# Altium schematic sheet sensor.SchDoc
size A4; SheetNumber: 1; SheetTotal: 1
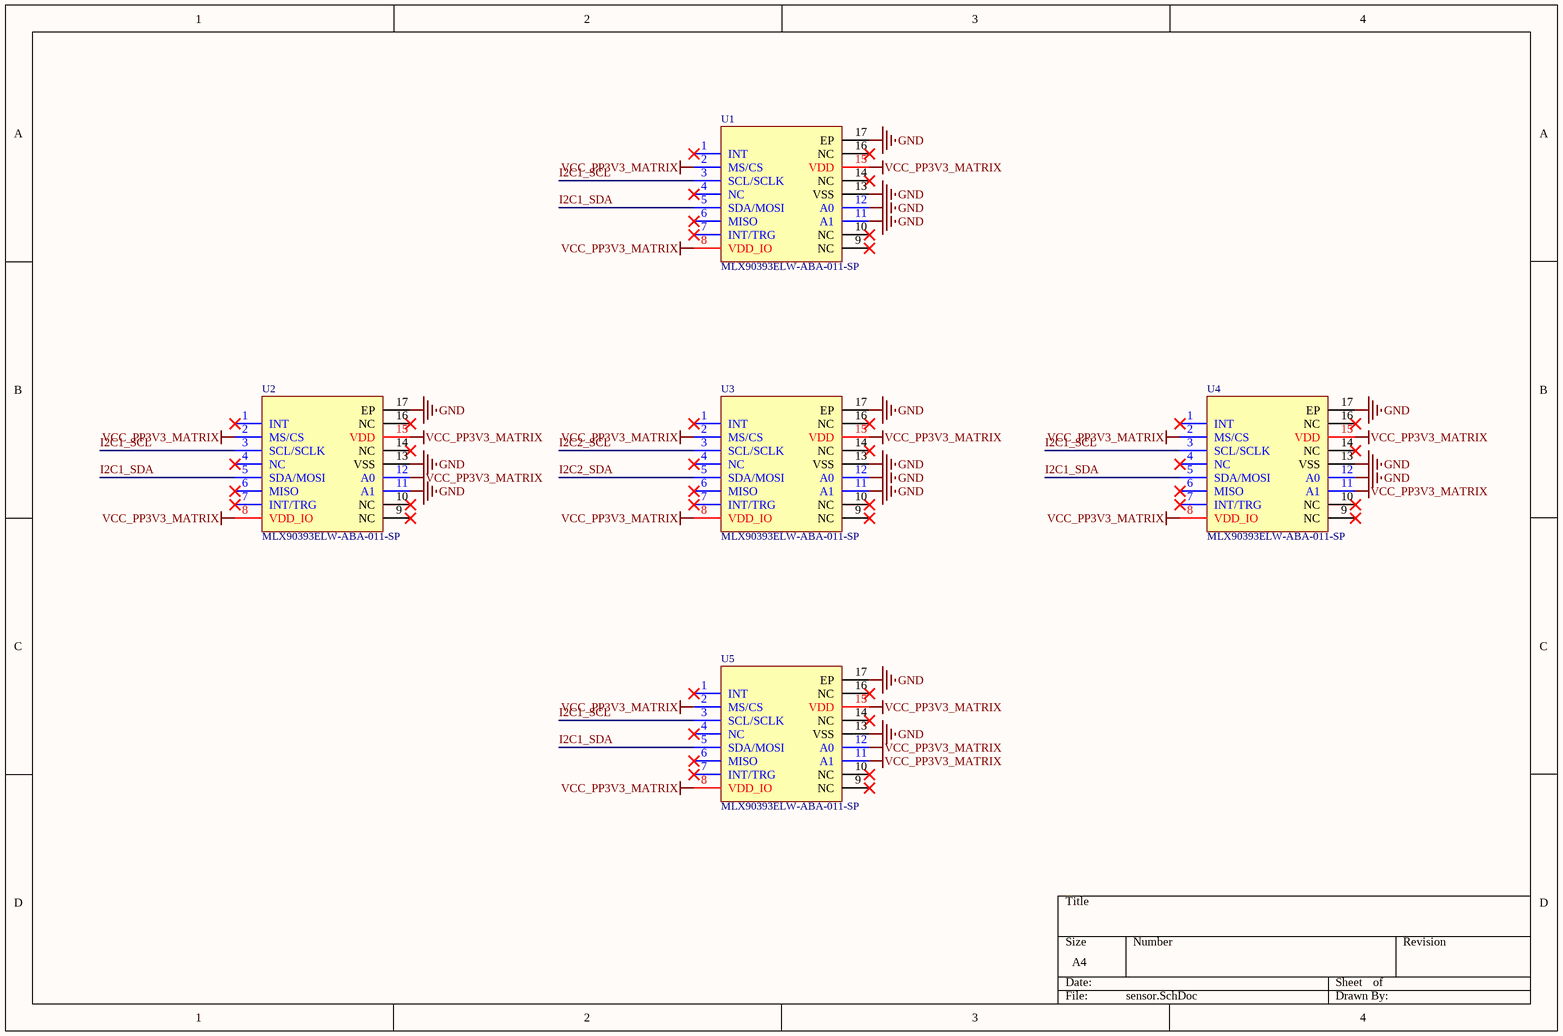
[diagram p0: sensor.SchDoc]

## Parts
U1  MLX90393ELW-ABA-011-SP  [QFN-16_L3.0-W3.0-P0.50-TR-EP1.7]
U2  MLX90393ELW-ABA-011-SP  [QFN-16_L3.0-W3.0-P0.50-TR-EP1.7]
U3  MLX90393ELW-ABA-011-SP  [QFN-16_L3.0-W3.0-P0.50-TR-EP1.7]
U4  MLX90393ELW-ABA-011-SP  [QFN-16_L3.0-W3.0-P0.50-TR-EP1.7]
U5  MLX90393ELW-ABA-011-SP  [QFN-16_L3.0-W3.0-P0.50-TR-EP1.7]

## Nets
GND: U1.11(A1) U1.12(A0) U1.13(VSS) U1.17(EP) U2.11(A1) U2.13(VSS) U2.17(EP) U3.11(A1) U3.12(A0) U3.13(VSS) U3.17(EP) U4.12(A0) U4.13(VSS) U4.17(EP) U5.13(VSS) U5.17(EP)
VCC_PP3V3_MATRIX: U1.2(MS/CS) U1.8(VDD_IO) U1.15(VDD) U2.2(MS/CS) U2.8(VDD_IO) U2.12(A0) U2.15(VDD) U3.2(MS/CS) U3.8(VDD_IO) U3.15(VDD) U4.2(MS/CS) U4.8(VDD_IO) U4.11(A1) U4.15(VDD) U5.2(MS/CS) U5.8(VDD_IO) U5.11(A1) U5.12(A0) U5.15(VDD)
I2C1_SCL: U1.3(SCL/SCLK) U2.3(SCL/SCLK) U4.3(SCL/SCLK) U5.3(SCL/SCLK)
I2C1_SDA: U1.5(SDA/MOSI) U2.5(SDA/MOSI) U4.5(SDA/MOSI) U5.5(SDA/MOSI)
I2C2_SCL: U3.3(SCL/SCLK)
I2C2_SDA: U3.5(SDA/MOSI)

Not connected (* = marked no-connect by the designer): U1 1(INT)* 4(NC)* 6(MISO)* 7(INT/TRG)* 9(NC)* 10(NC)* 14(NC)* 16(NC)*; U2 1(INT)* 4(NC)* 6(MISO)* 7(INT/TRG)* 9(NC)* 10(NC)* 14(NC)* 16(NC)*; U3 1(INT)* 4(NC)* 6(MISO)* 7(INT/TRG)* 9(NC)* 10(NC)* 14(NC)* 16(NC)*; U4 1(INT)* 4(NC)* 6(MISO)* 7(INT/TRG)* 9(NC)* 10(NC)* 14(NC)* 16(NC)*; U5 1(INT)* 4(NC)* 6(MISO)* 7(INT/TRG)* 9(NC)* 10(NC)* 14(NC)* 16(NC)*

## Library data of the parts
U1-U5 = MLX90393ELW-ABA-011-SP: 3D磁传感器; BOM_Manufacturer: Melexis(比利时迈来芯); Contributor: LCSC; BOM_Supplier: LCSC; BOM_Supplier Part: C1526586; BOM_Manufacturer Part: MLX90393ELW-ABA-011-SP; BOM_JLCPCB Part Class: Extended Part; spicePre: U; spiceSymbolName: MLX90393ELW-ABA-011-SP